# Altium schematic sheet Sch_Dr_Mag .SchDoc
size A4 portrait
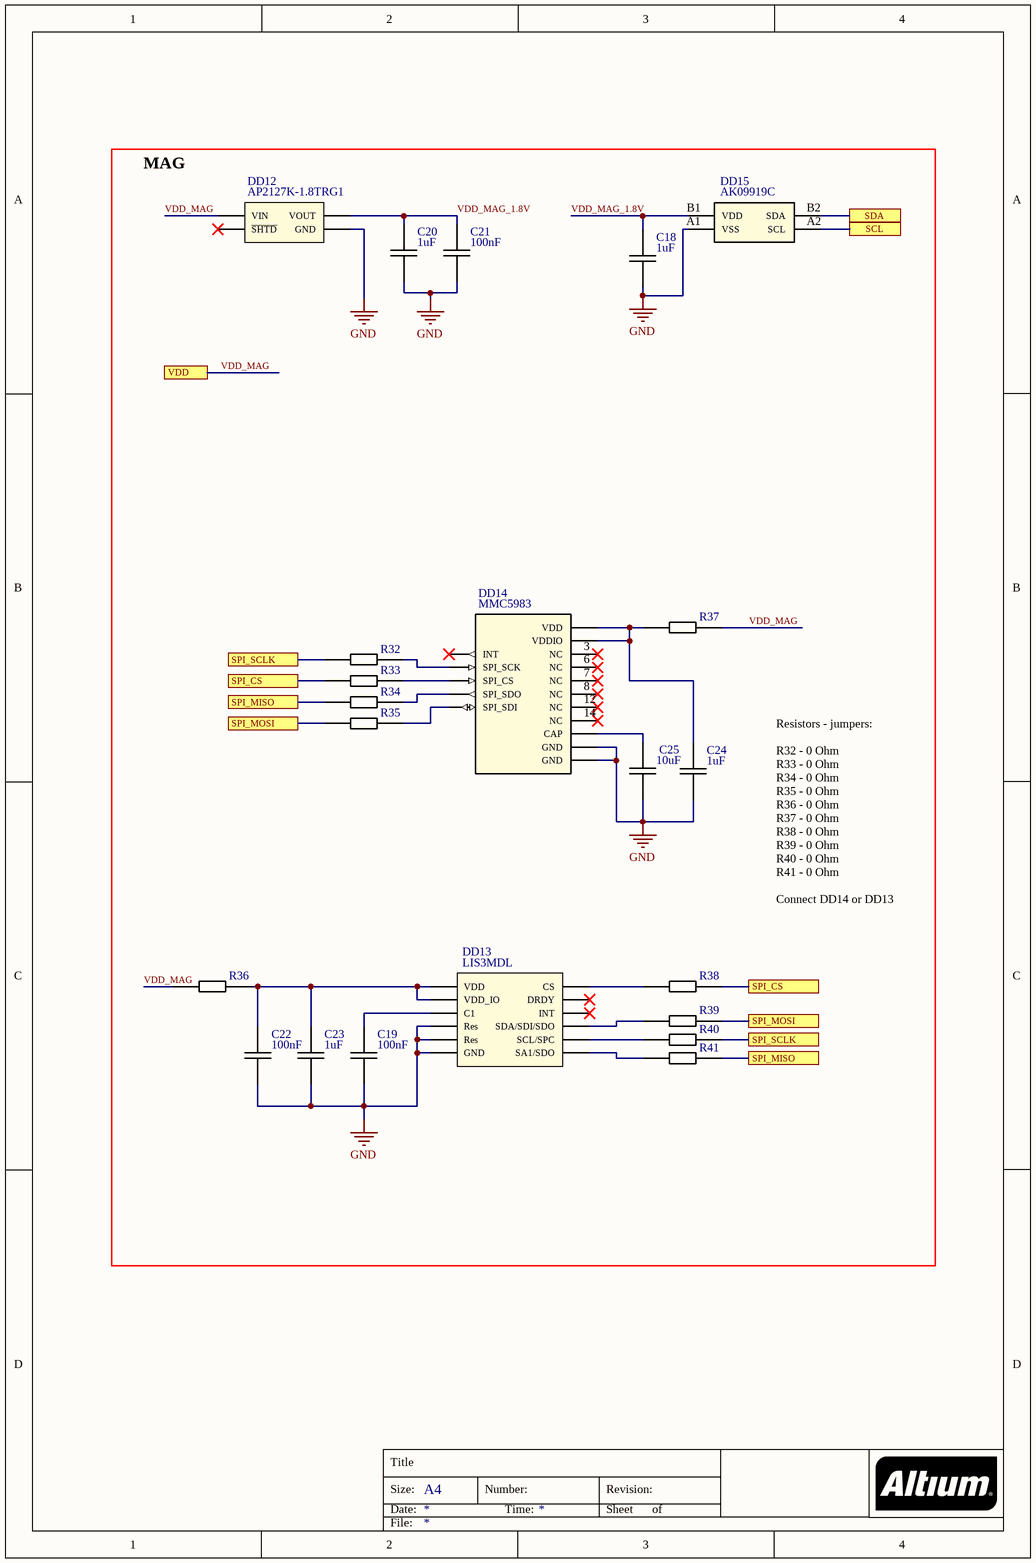
[diagram p0: Sch_Dr_Mag .SchDoc]

## Parts
C18  1uF  [Cap_0603]
C19  100nF  [Cap_0603]
C20  1uF  [Cap_0603]
C21  100nF  [Cap_0603]
C22  100nF  [Cap_0603]
C23  1uF  [Cap_0603]
C24  1uF  [Cap_0603]
C25  10uF  [Cap_0603]
DD12  AP2127K-1.8TRG1  [SOT-23-5]
DD13  LIS3MDL  [LGA-12]
DD14  MMC5983  [LGA-16]
DD15  AK09919C  [AK09916]
R32  0  [Res_0402]  (value not drawn)
R33  0  [Res_0402]  (value not drawn)
R34  0  [Res_0402]  (value not drawn)
R35  0  [Res_0402]  (value not drawn)
R36  0  [Res_0402]  (value not drawn)
R37  0  [Res_0402]  (value not drawn)
R38  0  [Res_0402]  (value not drawn)
R39  0  [Res_0402]  (value not drawn)
R40  0  [Res_0402]  (value not drawn)
R41  0  [Res_0402]  (value not drawn)

## Blocks framed on the sheet
MAG: C18-C25 DD12-DD15 R32-R41

## Ports
SCL, SDA, SPI_CS, SPI_MISO, SPI_MOSI, SPI_SCLK, VDD

## Nets
GND: C18.1 C19.1 C20.1 C21.1 C22.1 C23.1 C24.1 C25.1 DD12.2(GND) DD13.2(Res) DD13.3(GND) DD13.12(Res) DD14.9(GND) DD14.11(GND) DD15.A1(VSS)
SCL: DD15.A2(SCL) ; port SCL
SDA: DD15.B2(SDA) ; port SDA
SPI_CS: R33.1 R38.2 ; port SPI_CS
SPI_MISO: R34.1 R41.2 ; port SPI_MISO
SPI_MOSI: R35.1 R39.2 ; port SPI_MOSI
SPI_SCLK: R32.1 R40.2 ; port SPI_SCLK
VDD_MAG: DD12.1(VIN) R36.1 R37.2 ; port VDD
VDD_MAG_1.8V: C18.2 C20.2 C21.2 DD12.5(VOUT) DD15.B1(VDD)
NetC19_2: C19.2 DD13.4(C1)
NetC22_2: C22.2 C23.2 DD13.5(VDD) DD13.6(VDD_IO) R36.2
NetC24_2: C24.2 DD14.2(VDD) DD14.13(VDDIO) R37.1
NetC25_2: C25.2 DD14.10(CAP)
NetDD13_1: DD13.1(SCL/SPC) R40.1
NetDD13_9: DD13.9(SA1/SDO) R41.1
NetDD13_10: DD13.10(CS) R38.1
NetDD13_11: DD13.11(SDA/SDI/SDO) R39.1
NetDD14_1: DD14.1(SPI_SCK) R32.2
NetDD14_4: DD14.4(SPI_CS) R33.2
NetDD14_5: DD14.5(SPI_SDO) R34.2
NetDD14_16: DD14.16(SPI_SDI) R35.2

Not connected (* = marked no-connect by the designer): DD12 3(~{SHTD})*; DD13 7(INT)* 8(DRDY)*; DD14 3(NC)* 6(NC)* 7(NC)* 8(NC)* 12(NC)* 14(NC)* 15(INT)*

## Notes on the sheet
- Resistors - jumpers:
  R32 - 0 Ohm
  R33 - 0 Ohm
  R34 - 0 Ohm
  R35 - 0 Ohm
  R36 - 0 Ohm
  R37 - 0 Ohm
  R38 - 0 Ohm
  R39 - 0 Ohm
  R40 - 0 Ohm
  R41 - 0 Ohm
  Connect DD14 or DD13
- Title
- Size:
- Date:
- A4
- Number:
- Time:
- Revision:
- Sheet
- of
- File:

## Library data of the parts
C18 C20 C23 C24 = Cap_: CC0603JRX7R7BB105
C19 C21 C22 = Cap_: CC0603JRX7R8BB104
C25 = Cap_: CC0603KRX5R7BB106
DD12 = AP2127K-1.8TRG1: 300mA High Speed, Extremely low noise CMOS LDO regulator
DD13 = LIS3MDL: Ultra-low power, high-perfomance 3-axis magnetometer.
DD14 = MMC5983: 3-axis Magnetic Sensor
DD15 = AK09919C: 3-axis Electronic Compass, 1.8V.
R32-R41 = Res_: RC0402FR-070RL